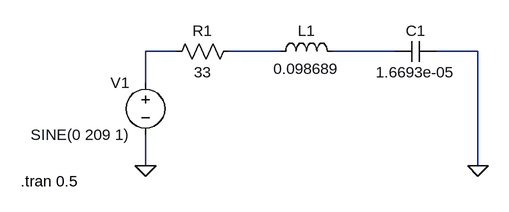
[diagram p0: schematic Var31_series.asc]
Var31_series.asc, the LTspice schematic file:
Version 4
SHEET 1 880 680
WIRE 32 -304 -16 -304
WIRE 192 -304 112 -304
WIRE 368 -304 272 -304
WIRE 496 -304 432 -304
WIRE -16 -256 -16 -304
WIRE -16 -128 -16 -176
WIRE 496 -128 496 -304
FLAG -16 -128 0
FLAG 496 -128 0
SYMBOL res 16 -288 R270
WINDOW 0 32 56 VTop 2
WINDOW 3 0 56 VBottom 2
SYMATTR InstName R1
SYMATTR Value 33
SYMBOL ind 176 -288 R270
WINDOW 0 32 56 VTop 2
WINDOW 3 5 56 VBottom 2
SYMATTR InstName L1
SYMATTR Value 0.098689
SYMATTR SpiceLine Rser=7
SYMBOL cap 432 -320 R90
WINDOW 0 0 32 VBottom 2
WINDOW 3 32 32 VTop 2
SYMATTR InstName C1
SYMATTR Value 1.6693e-05
SYMBOL voltage -16 -272 M0
WINDOW 123 0 0 Left 0
WINDOW 39 0 0 Left 0
SYMATTR InstName V1
SYMATTR Value SINE(0 209 1)
TEXT -208 -104 Left 2 !.tran 0.5

The netlist it stands for:
* Var31_series.asc
R1 N001 N002 33
L1 N002 N003 0.098689 Rser=7
C1 0 N003 1.6693e-05
V1 N001 0 SINE(0 209 1)
.tran 0.5
.backanno
.end